# Altium project LINKER.PrjPcb
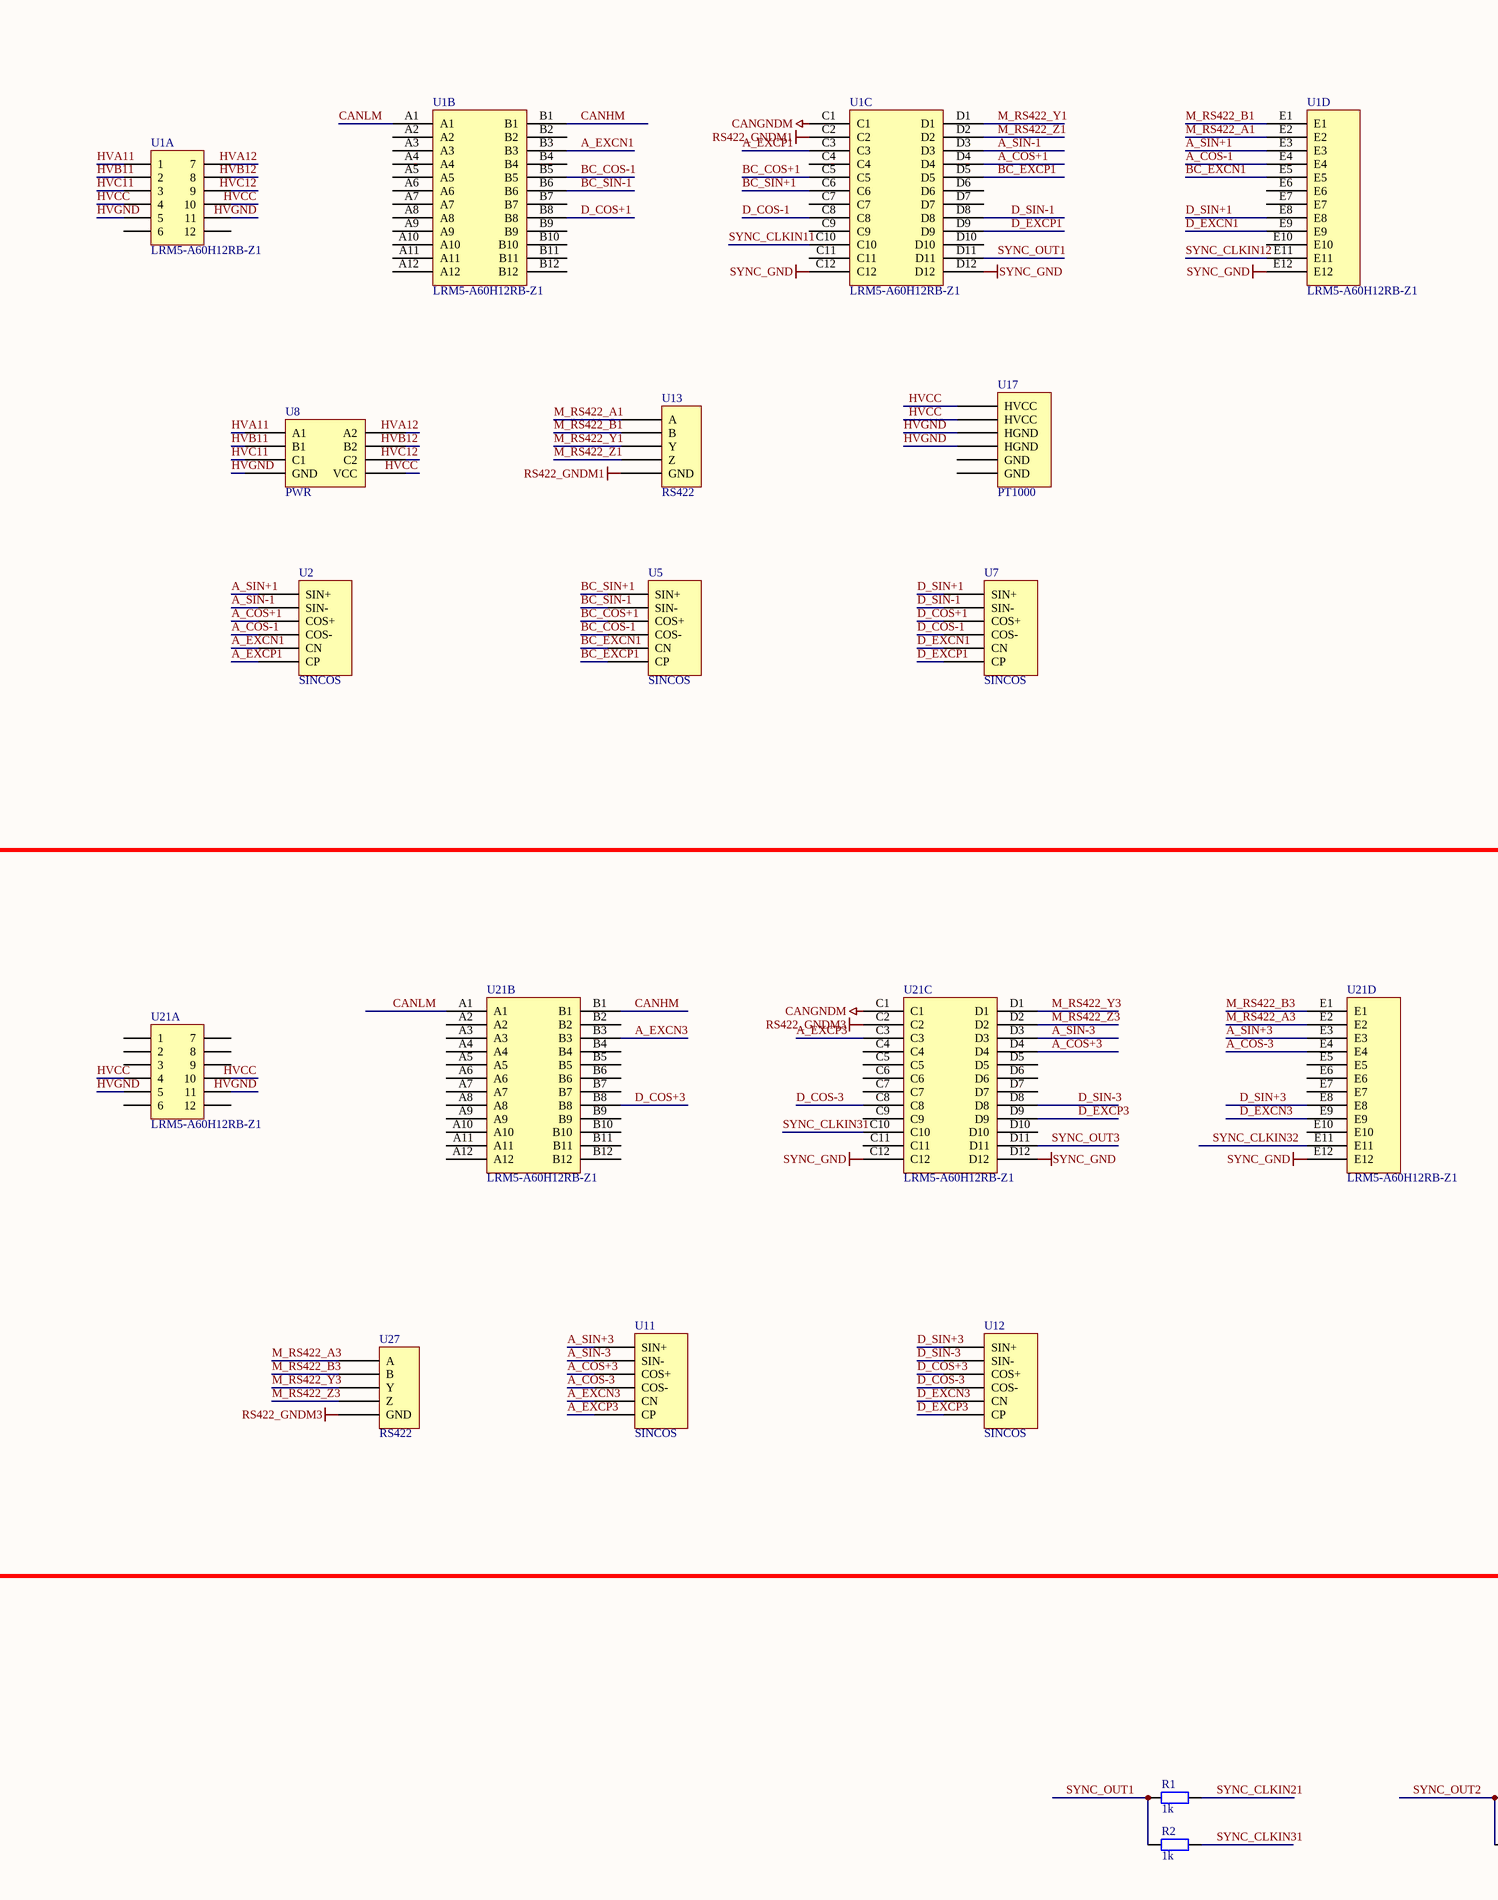
[diagram p0: LINKER.SchDoc, left]
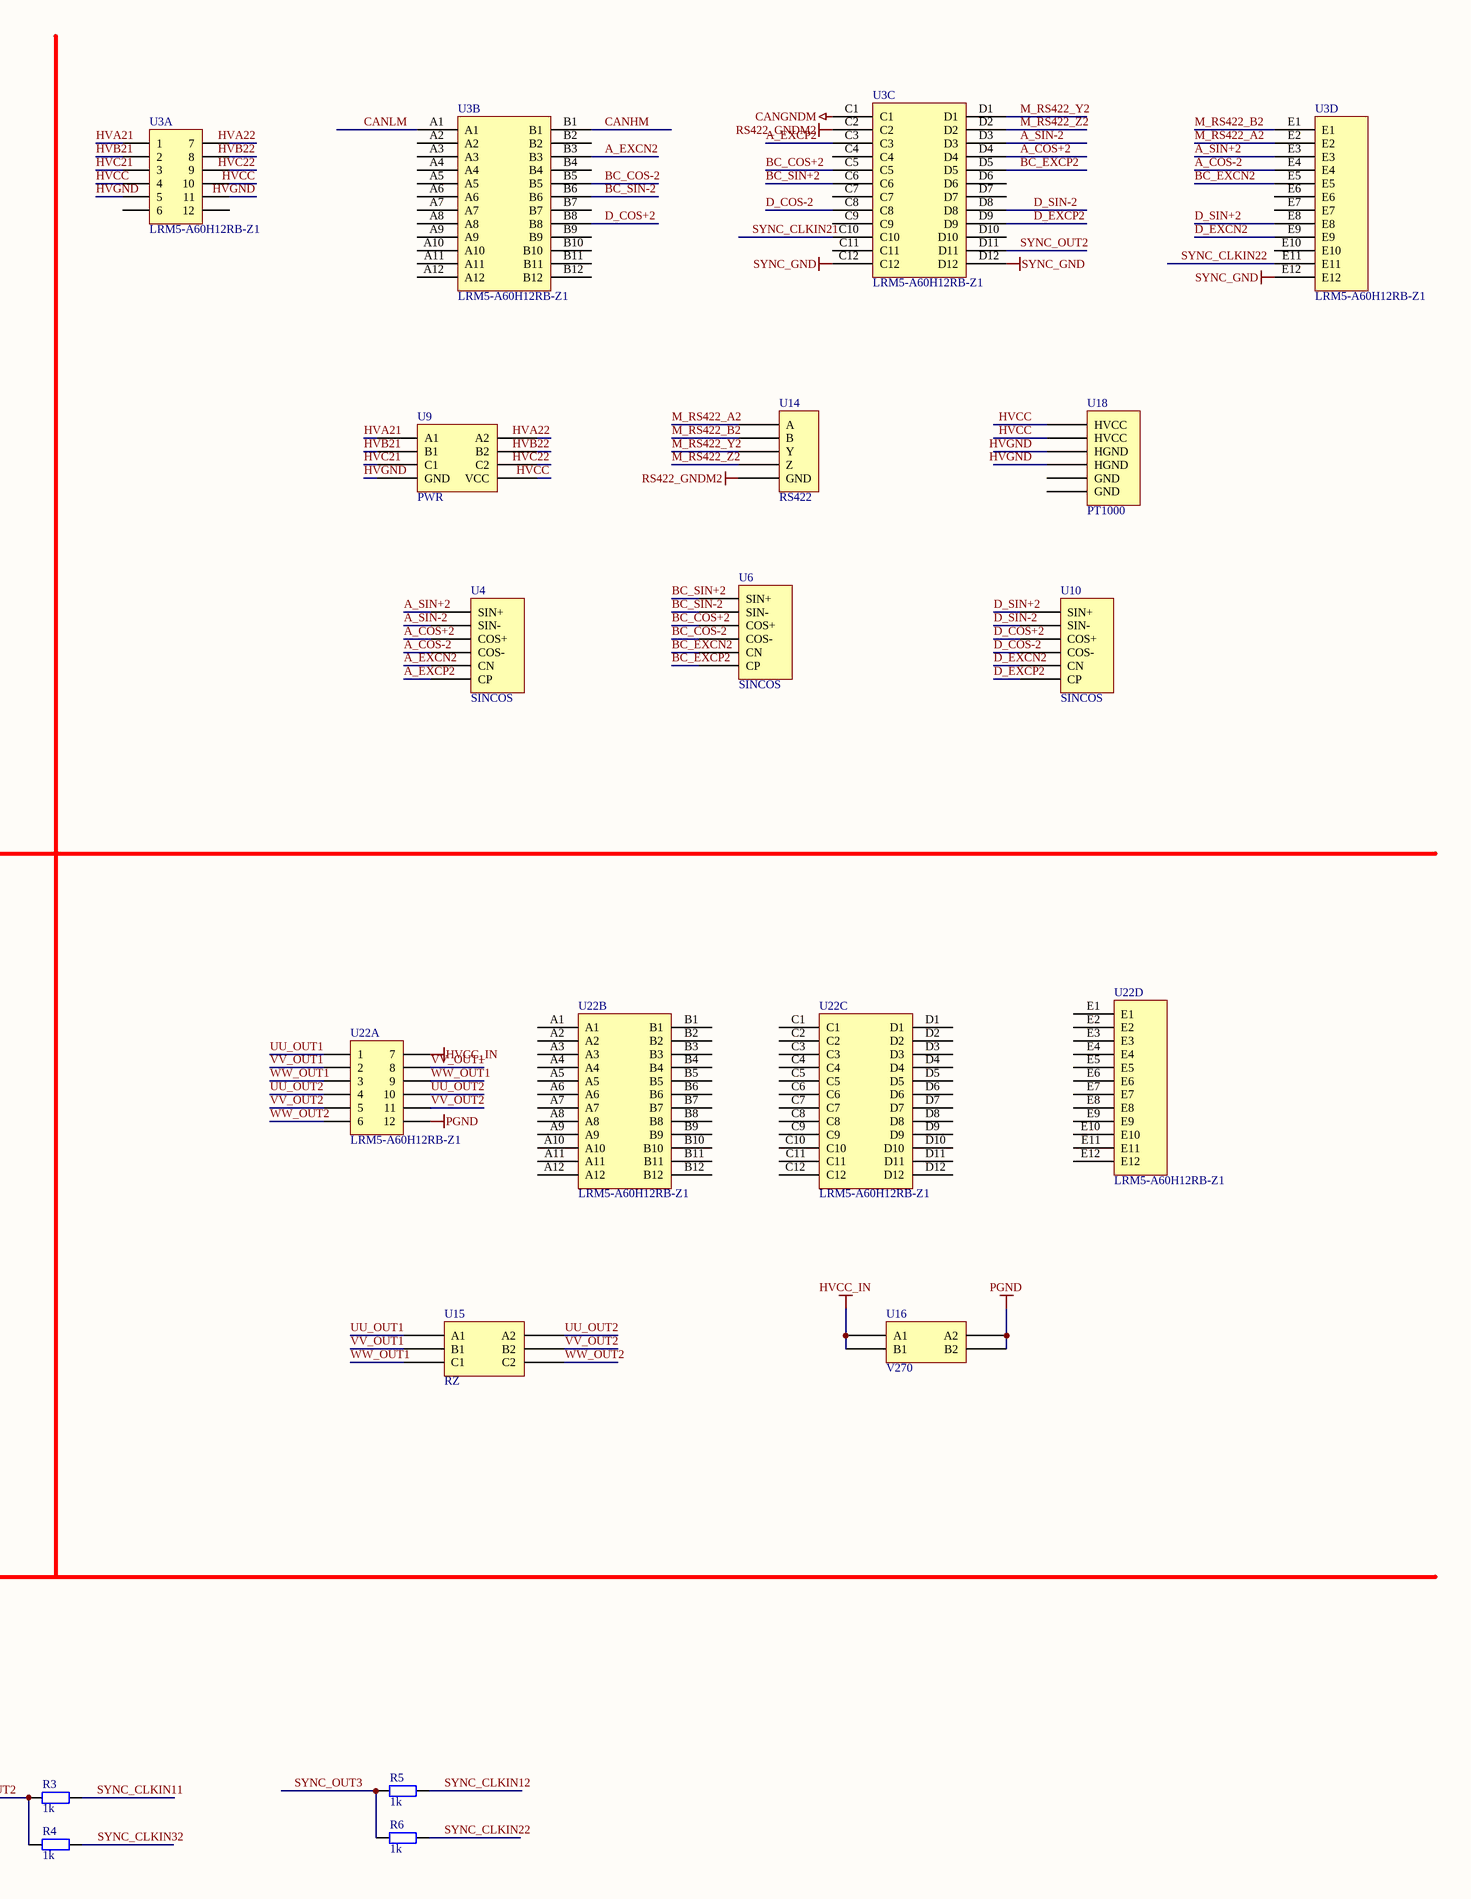
[diagram p1: LINKER.SchDoc, right]
1 sheet, 27 parts. Net scope: global (net labels, ports and power ports of the same name join across sheets).
Board file: LINKER.PcbDoc

## Sheet LINKER.SchDoc
size A2

### Parts
R1  1k  [R1608-0603]
R2  1k  [R1608-0603]
R3  1k  [R1608-0603]
R4  1k  [R1608-0603]
R5  1k  [R1608-0603]
R6  1k  [R1608-0603]
U1  LRM5-A60H12RB-Z1  [LRM5-A60H12RB-Z1]  (parts A,B,C,D of 4)
U2  SINCOS  [SINCOS]
U3  LRM5-A60H12RB-Z1  [LRM5-A60H12RB-Z1]  (parts A,B,C,D of 4)
U4  SINCOS  [SINCOS]
U5  SINCOS  [SINCOS]
U6  SINCOS  [SINCOS]
U7  SINCOS  [SINCOS]
U8  PWR  [PWR]
U9  PWR  [PWR]
U10  SINCOS  [SINCOS]
U11  SINCOS  [SINCOS]
U12  SINCOS  [SINCOS]
U13  RS422  [RS422]
U14  RS422  [RS422]
U15  RZ  [RZ]
U16  V270  [V270]
U17  PT1000  [PT1000]
U18  PT1000  [PT1000]
U21  LRM5-A60H12RB-Z1  [LRM5-A60H12RB-Z1]  (parts A,B,C,D of 4)
U22  LRM5-A60H12RB-Z1  [LRM5-A60H12RB-Z1]  (parts A,B,C,D of 4)
U27  RS422  [RS422]

### Nets
CANGNDM: U1.C1 U3.C1 U21.C1
HVCC_IN: U16.1(A1) U16.2(B1) U22.7
PGND: U16.3(A2) U16.4(B2) U22.12
RS422_GNDM1: U1.C2 U13.5(GND)
RS422_GNDM2: U3.C2 U14.5(GND)
RS422_GNDM3: U21.C2 U27.5(GND)
SYNC_GND: U1.C12 U1.D12 U1.E12 U3.C12 U3.D12 U3.E12 U21.C12 U21.D12 U21.E12
A_COS+1: U1.D4 U2.3(COS+)
A_COS+2: U3.D4 U4.3(COS+)
A_COS+3: U11.3(COS+) U21.D4
A_COS-1: U1.E4 U2.4(COS-)
A_COS-2: U3.E4 U4.4(COS-)
A_COS-3: U11.4(COS-) U21.E4
A_EXCN1: U1.B3 U2.5(CN)
A_EXCN2: U3.B3 U4.5(CN)
A_EXCN3: U11.5(CN) U21.B3
A_EXCP1: U1.C3 U2.6(CP)
A_EXCP2: U3.C3 U4.6(CP)
A_EXCP3: U11.6(CP) U21.C3
A_SIN+1: U1.E3 U2.1(SIN+)
A_SIN+2: U3.E3 U4.1(SIN+)
A_SIN+3: U11.1(SIN+) U21.E3
A_SIN-1: U1.D3 U2.2(SIN-)
A_SIN-2: U3.D3 U4.2(SIN-)
A_SIN-3: U11.2(SIN-) U21.D3
BC_COS+1: U1.C5 U5.3(COS+)
BC_COS+2: U3.C5 U6.3(COS+)
BC_COS-1: U1.B5 U5.4(COS-)
BC_COS-2: U3.B5 U6.4(COS-)
BC_EXCN1: U1.E5 U5.5(CN)
BC_EXCN2: U3.E5 U6.5(CN)
BC_EXCP1: U1.D5 U5.6(CP)
BC_EXCP2: U3.D5 U6.6(CP)
BC_SIN+1: U1.C6 U5.1(SIN+)
BC_SIN+2: U3.C6 U6.1(SIN+)
BC_SIN-1: U1.B6 U5.2(SIN-)
BC_SIN-2: U3.B6 U6.2(SIN-)
CANHM: U1.B1 U3.B1 U21.B1
CANLM: U1.A1 U3.A1 U21.A1
D_COS+1: U1.B8 U7.3(COS+)
D_COS+2: U3.B8 U10.3(COS+)
D_COS+3: U12.3(COS+) U21.B8
D_COS-1: U1.C8 U7.4(COS-)
D_COS-2: U3.C8 U10.4(COS-)
D_COS-3: U12.4(COS-) U21.C8
D_EXCN1: U1.E9 U7.5(CN)
D_EXCN2: U3.E9 U10.5(CN)
D_EXCN3: U12.5(CN) U21.E9
D_EXCP1: U1.D9 U7.6(CP)
D_EXCP2: U3.D9 U10.6(CP)
D_EXCP3: U12.6(CP) U21.D9
D_SIN+1: U1.E8 U7.1(SIN+)
D_SIN+2: U3.E8 U10.1(SIN+)
D_SIN+3: U12.1(SIN+) U21.E8
D_SIN-1: U1.D8 U7.2(SIN-)
D_SIN-2: U3.D8 U10.2(SIN-)
D_SIN-3: U12.2(SIN-) U21.D8
HVA11: U1.1 U8.1(A1)
HVA12: U1.7 U8.4(A2)
HVA21: U3.1 U9.1(A1)
HVA22: U3.7 U9.4(A2)
HVB11: U1.2 U8.2(B1)
HVB12: U1.8 U8.5(B2)
HVB21: U3.2 U9.2(B1)
HVB22: U3.8 U9.5(B2)
HVC11: U1.3 U8.3(C1)
HVC12: U1.9 U8.6(C2)
HVC21: U3.3 U9.3(C1)
HVC22: U3.9 U9.6(C2)
HVCC: U1.4 U1.10 U3.4 U3.10 U8.8(VCC) U9.8(VCC) U17.1(HVCC) U17.2(HVCC) U18.1(HVCC) U18.2(HVCC) U21.4 U21.10
HVGND: U1.5 U1.11 U3.5 U3.11 U8.7(GND) U9.7(GND) U17.3(HGND) U17.4(HGND) U18.3(HGND) U18.4(HGND) U21.5 U21.11
M_RS422_A1: U1.E2 U13.1(A)
M_RS422_A2: U3.E2 U14.1(A)
M_RS422_A3: U21.E2 U27.1(A)
M_RS422_B1: U1.E1 U13.2(B)
M_RS422_B2: U3.E1 U14.2(B)
M_RS422_B3: U21.E1 U27.2(B)
M_RS422_Y1: U1.D1 U13.3(Y)
M_RS422_Y2: U3.D1 U14.3(Y)
M_RS422_Y3: U21.D1 U27.3(Y)
M_RS422_Z1: U1.D2 U13.4(Z)
M_RS422_Z2: U3.D2 U14.4(Z)
M_RS422_Z3: U21.D2 U27.4(Z)
SYNC_CLKIN11: R3.2 U1.C10
SYNC_CLKIN12: R5.2 U1.E11
SYNC_CLKIN21: R1.2 U3.C10
SYNC_CLKIN22: R6.2 U3.E11
SYNC_CLKIN31: R2.2 U21.C10
SYNC_CLKIN32: R4.2 U21.E11
SYNC_OUT1: R1.1 R2.1 U1.D11
SYNC_OUT2: R3.1 R4.1 U3.D11
SYNC_OUT3: R5.1 R6.1 U21.D11
UU_OUT1: U15.1(A1) U22.1
UU_OUT2: U15.4(A2) U22.4 U22.10
VV_OUT1: U15.2(B1) U22.2 U22.8
VV_OUT2: U15.5(B2) U22.5 U22.11
WW_OUT1: U15.3(C1) U22.3 U22.9
WW_OUT2: U15.6(C2) U22.6

Not connected (* = marked no-connect by the designer): U1 6 12 A2 A3 A4 A5 A6 A7 A8 A9 A10 A11 A12 B2 B4 B7 B9 B10 B11 B12 C4 C7 C9 C11 D6 D7 D10 E6 E7 E10; U3 6 12 A2 A3 A4 A5 A6 A7 A8 A9 A10 A11 A12 B2 B4 B7 B9 B10 B11 B12 C4 C7 C9 C11 D6 D7 D10 E6 E7 E10; U17 5(GND) 6(GND); U18 5(GND) 6(GND); U21 1 2 3 6 7 8 9 12 A2 A3 A4 A5 A6 A7 A8 A9 A10 A11 A12 B2 B4 B5 B6 B7 B9 B10 B11 B12 C4 C5 C6 C7 C9 C11 D5 D6 D7 D10 E5 E6 E7 E10; U22 A1 A2 A3 A4 A5 A6 A7 A8 A9 A10 A11 A12 B1 B2 B3 B4 B5 B6 B7 B8 B9 B10 B11 B12 C1 C2 C3 C4 C5 C6 C7 C8 C9 C10 C11 C12 D1 D2 D3 D4 D5 D6 D7 D8 D9 D10 D11 D12 E1 E2 E3 E4 E5 E6 E7 E8 E9 E10 E11 E12

### Library data of the parts
R1-R6 = RMK1608MB: 电阻器; 技术标准: GJB1432B-2009; 型号: RMK1608MBXXXJ; 生产厂家: 云科; 质量等级: GJB
U1 U3 U21 U22 = MULTI_HEADER